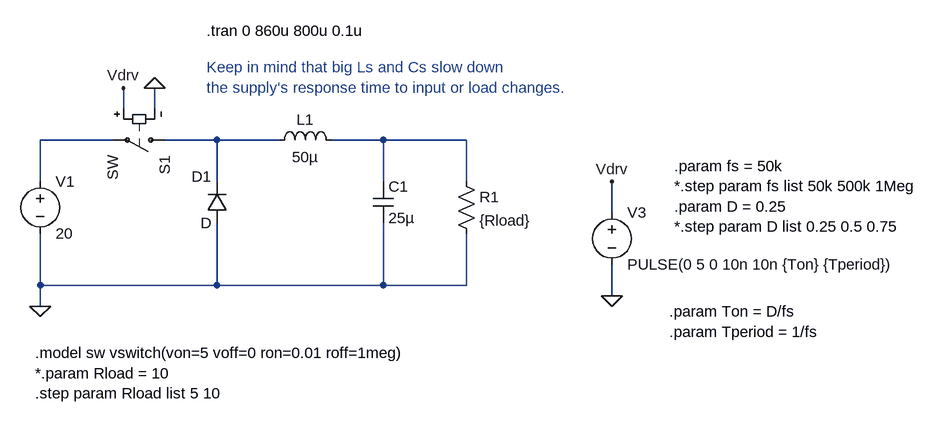
[diagram p0: schematic buck.asc]
buck.asc, the LTspice schematic file:
Version 4
SHEET 1 1804 680
WIRE -80 48 -80 16
WIRE -32 48 -32 16
WIRE -96 96 -208 96
WIRE 64 96 -16 96
WIRE 160 96 64 96
WIRE 320 96 240 96
WIRE 448 96 320 96
WIRE -208 160 -208 96
WIRE 64 160 64 96
WIRE 320 160 320 96
WIRE 448 160 448 96
WIRE 672 208 672 160
WIRE -208 320 -208 240
WIRE 64 320 64 224
WIRE 64 320 -208 320
WIRE 320 320 320 224
WIRE 320 320 64 320
WIRE 448 320 448 240
WIRE 448 320 320 320
WIRE 672 336 672 288
WIRE -208 352 -208 320
FLAG -208 352 0
FLAG 672 336 0
FLAG 672 160 Vdrv
FLAG -80 16 Vdrv
FLAG -32 16 0
SYMBOL ind 144 112 R270
WINDOW 0 32 56 VTop 0
WINDOW 3 5 56 VBottom 0
SYMATTR InstName L1
SYMATTR Value 50µ
SYMBOL cap 304 160 R0
SYMATTR InstName C1
SYMATTR Value 25µ
SYMBOL voltage -208 144 R0
WINDOW 123 0 0 Left 0
WINDOW 39 0 0 Left 0
SYMATTR InstName V1
SYMATTR Value 20
SYMBOL sw 0 96 R90
SYMATTR InstName S1
SYMBOL res 432 144 R0
SYMATTR InstName R1
SYMATTR Value {Rload}
SYMBOL diode 80 224 R180
WINDOW 0 24 72 Left 0
WINDOW 3 24 0 Left 0
SYMATTR InstName D1
SYMBOL voltage 672 192 R0
WINDOW 123 0 0 Left 0
WINDOW 39 0 0 Left 0
SYMATTR InstName V3
SYMATTR Value PULSE(0 5 0 10n 10n {Ton} {Tperiod})
TEXT 48 -72 Left 0 !.tran 0 860u 800u 0.1u
TEXT -216 424 Left 0 !.model sw vswitch(von=5 voff=0 ron=0.01 roff=1meg)\n*.param Rload = 10\n.step param Rload list 5 10
TEXT 48 -16 Left 0 ;Keep in mind that big Ls and Cs slow down\nthe supply's response time to input or load changes.
TEXT 768 136 Left 0 !.param fs = 50k\n*.step param fs list 50k 500k 1Meg\n.param D = 0.25\n*.step param D list 0.25 0.5 0.75
TEXT 760 360 Left 0 !.param Ton = D/fs\n.param Tperiod = 1/fs

The netlist it stands for:
* buck.asc
L1 N002 N003 50µ
C1 N003 0 25µ
V1 N001 0 20
S1 N002 N001 Vdrv 0 SW
R1 N003 0 {Rload}
D1 0 N002 D
V3 Vdrv 0 PULSE(0 5 0 10n 10n {Ton} {Tperiod})
.model D D
.lib standard.dio
.tran 0 860u 800u 0.1u
.model sw vswitch(von=5 voff=0 ron=0.01 roff=1meg)
*.param Rload = 10
.step param Rload list 5 10
* Keep in mind that big Ls and Cs slow down
* the supply's response time to input or load changes.
.param fs = 50k
*.step param fs list 50k 500k 1Meg
.param D = 0.25
*.step param D list 0.25 0.5 0.75
.param Ton = D/fs
.param Tperiod = 1/fs
.backanno
.end